# Altium project QUTMS_RadioPod_V2.PrjPcb
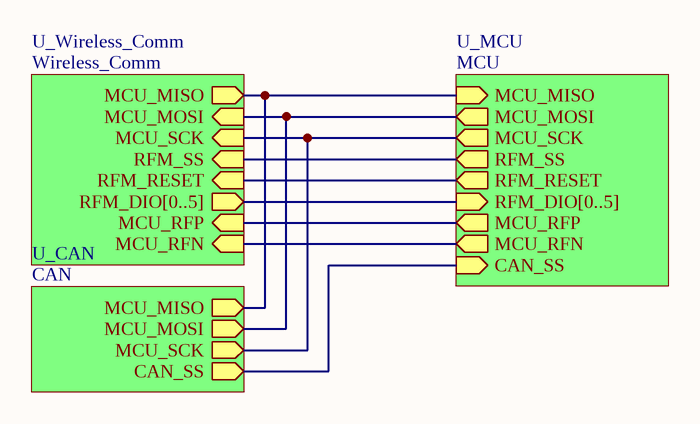
[diagram p0: QUTMS_Radio_Pod.SchDoc]
2 sheets, 5 parts. Net scope: hierarchical (ports join the sheet entries above them; power ports are global).
Sheets:
  QUTMS_Radio_Pod.SchDoc
    U_Wireless_Comm = Wireless_Comm.SchDoc

## Sheet QUTMS_Radio_Pod.SchDoc: Radio Pod
size A4

### Sub-sheets
U_CAN = CAN (file not in this document): MCU_MISO (out), MCU_MOSI (out), MCU_SCK (out), CAN_SS (out)
U_MCU = MCU (file not in this document): MCU_MISO (in), MCU_MOSI (out), MCU_SCK (out), RFM_SS (out), RFM_RESET (out), RFM_DIO[0..5] (in), MCU_RFP (out), MCU_RFN (out), CAN_SS (in)
U_Wireless_Comm = Wireless_Comm: MCU_MISO (out), MCU_MOSI (in), MCU_SCK (in), RFM_SS (in), RFM_RESET (in), RFM_DIO[0..5] (out), MCU_RFP (in), MCU_RFN (in)

### Nets
NetFL?_3: sheet U_Wireless_Comm/MCU_RFN, sheet U_MCU/MCU_RFN
NetFL?_4: sheet U_Wireless_Comm/MCU_RFP, sheet U_MCU/MCU_RFP
NetM?_10: sheet U_Wireless_Comm/MCU_MISO, sheet U_CAN/MCU_MISO, sheet U_MCU/MCU_MISO
NetM?_11: sheet U_Wireless_Comm/MCU_MOSI, sheet U_CAN/MCU_MOSI, sheet U_MCU/MCU_MOSI
NetM?_12: sheet U_Wireless_Comm/MCU_SCK, sheet U_CAN/MCU_SCK, sheet U_MCU/MCU_SCK
NetM?_13: sheet U_Wireless_Comm/RFM_SS, sheet U_MCU/RFM_SS
NetM?_14: sheet U_Wireless_Comm/RFM_RESET, sheet U_MCU/RFM_RESET
(unnamed): sheet U_CAN/CAN_SS, sheet U_MCU/CAN_SS

### Buses and harness runs
bus sheet U_MCU/RFM_DIO[0..5] = sheet U_Wireless_Comm/RFM_DIO[0..5]

### Notes on the sheet
- Title
- Size:
- Date:
- A4
- Number:
- Time:
- Revision:
- Sheet
- of
- File:

## Sheet Wireless_Comm.SchDoc: Radio Pod - Wireless Communication
size A4
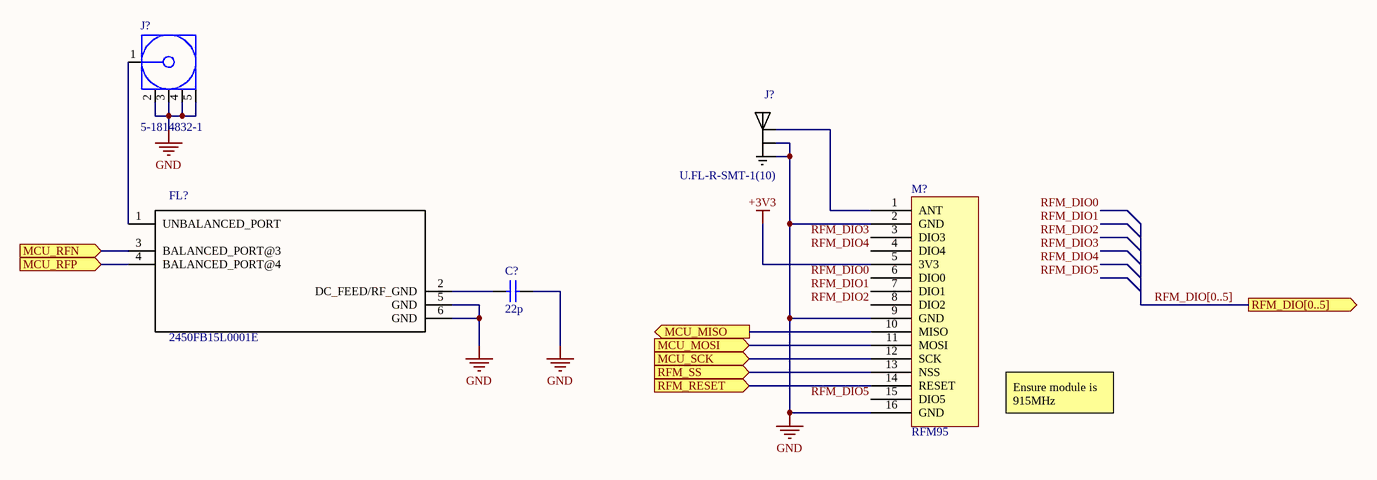
[diagram p1: Wireless_Comm.SchDoc]

### Parts
(Parts that share a designator on the sheet are numbered #1, #2 ... from top to bottom, then left to right.)
C?  22p  [CAPC2013X88X50ML20T25]
FL?  2450FB15L0001E  [*FILTER_2450FB15L0001E]
J?#1  5-1814832-1  [TECO-5-1814832-1_V]
J?#2  U.FL-R-SMT-1(10)  [*HRS_U.FL-R-SMT-1(10)]
M?  RFM95  [RFM95]

### Ports
MCU_MISO (out), MCU_MOSI (in), MCU_RFN (in), MCU_RFP (in), MCU_SCK (in), RFM_DIO[0..5] (out), RFM_RESET (in), RFM_SS (in)

### Nets
+3V3: M?.5(3V3)
GND: C?.2 FL?.5(GND) FL?.6(GND) J?#1.2 J?#1.3 J?#1.4 J?#1.5 J?#2.1(GND) J?#2.3(GND) M?.2(GND) M?.9(GND) M?.16(GND)
RFM_DIO0: M?.6(DIO0)
RFM_DIO1: M?.7(DIO1)
RFM_DIO2: M?.8(DIO2)
RFM_DIO3: M?.3(DIO3)
RFM_DIO4: M?.4(DIO4)
RFM_DIO5: M?.15(DIO5)
NetC?_1: C?.1 FL?.2(DC_FEED/RF_GND)
NetFL?_1: FL?.1(UNBALANCED_PORT) J?#1.1
NetFL?_3: FL?.3(BALANCED_PORT@3) ; port MCU_RFN
NetFL?_4: FL?.4(BALANCED_PORT@4) ; port MCU_RFP
NetJ?#2_2: J?#2.2(SIG) M?.1(ANT)
NetM?_10: M?.10(MISO) ; port MCU_MISO
NetM?_11: M?.11(MOSI) ; port MCU_MOSI
NetM?_12: M?.12(SCK) ; port MCU_SCK
NetM?_13: M?.13(NSS) ; port RFM_SS
NetM?_14: M?.14(RESET) ; port RFM_RESET

### Buses and harness runs
bus RFM_DIO[0..5] = port RFM_DIO[0..5]

### Notes on the sheet
- Ensure module is 915MHz
- Title
- Size:
- Date:
- A4
- Number:
- Time:
- Revision:
- Sheet
- of
- File:

### Library data of the parts
C? = CMP-2007-00448-1: Part Number: C0805C220J1GACTU; Manufacturer: Kemet
FL? = 2450FB15L0001E: BALUN FILTER, 2.45GHZ; Insertion Loss: 1.5dB; Balun Case Style: 0805; MF: Johanson; SnapEDA_Link: https://www.snapeda.com/parts/2450FB15L0001E/Johanson/view-part/?ref=snap; Digi-Key_Purchase_URL: https://www.digikey.com/product-detail/en/johanson-technology-inc/2450FB15L0001E/712-1538-1-ND/2392174?utm_source=snapeda&utm_medium=aggregator&utm_campaign=symbol; MP: 2450FB15L0001E; Digi-Key_Part_Number: 712-1538-1-ND; Package: 0805 Johanson; Value: *
J?#1 = CMP-2000-05415-1: SMA Connector, Pitch 5.08 mm, 1 Position, Height 9.5 mm, Tail Length 4 mm, -65 to 165 degC, RoHS, Bulk; Manufacturer: TE Connectivity; Connector Mounting: PCBMount; Connector Body Style: StraightJack; Impedance: 50ohm; Coaxial Termination: Solder; SVHC: NoSVHC(15-Jun-2015); Frequency Max: 3GHz; Product Range: ZDCSeries; Connector Type: SMACoaxial; Datasheet Version: Rev. B1, 03/2011; Package Reference: 5-1814832-1; Package Description: SMA Connector, Pitch 5.08 mm, 1 Position, Height 9.5 mm, Tail Length 4 mm; Contact Plating: GoldPlatedContacts; Coaxial Cable Types: -; Contact Material: BerylliumCopper; Manufacturer URL: http://www.te.com/; Datasheet URL: http://www.onlinecomponents.com/productFiles/mf-AMP/eng_cd_1814832_a.pdf
J?#2 = U.FL-R-SMT-1(10): U.FL Series 6 Ghz 50 Ohm Ultra-small SMT Coaxial Cable Receptacle; MF: Hirose; MP: U.FL-R-SMT-1_10_; SnapEDA_Link: https://www.snapeda.com/parts/U.FL-R-SMT-1%2810%29/Hirose%20Electric%20Co%20Ltd/view-part/?ref=snap; Digi-Key_Part_Number: H11891CT-ND; Digi-Key_Purchase_URL: https://www.digikey.com/product-detail/en/hirose-electric-co-ltd/U.FL-R-SMT-1_10_/H11891CT-ND/2504612?utm_source=snapeda&utm_medium=aggregator&utm_campaign=symbol; Package: None; Value: *
M? = RFM95: Manufacturer: HOPERF ELECTRONIC; Manufacturer Part No: RFM95; Order Code: *; Supplier: *; Component Type: Module